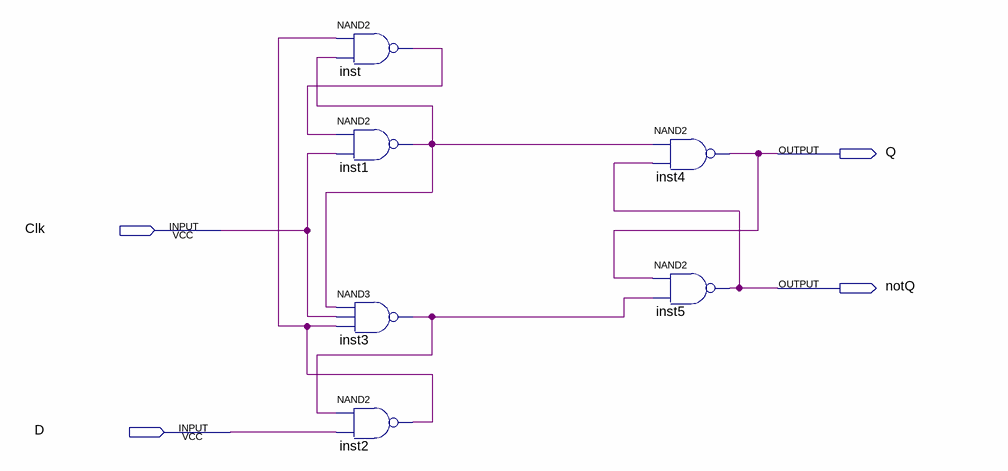
[diagram p0: schematic sheet]
// Quartus schematic lab9step3b.bdf as structural Verilog: 6 symbols, 4 pins
module lab9step3b (
  input  Clk,
  input  D,
  output Q,
  output notQ
);

  wire inst1_out, inst2_out, inst3_out, inst_out;

  nand inst (inst_out, inst2_out, inst1_out);
  nand inst1 (inst1_out, inst_out, Clk);
  nand inst3 (inst3_out, inst1_out, Clk, inst2_out);
  nand inst2 (inst2_out, inst3_out, D);
  nand inst4 (Q, inst1_out, notQ);
  nand inst5 (notQ, Q, inst3_out);
endmodule
